# Altium schematic sheet BatteryPack.SchDoc
size A
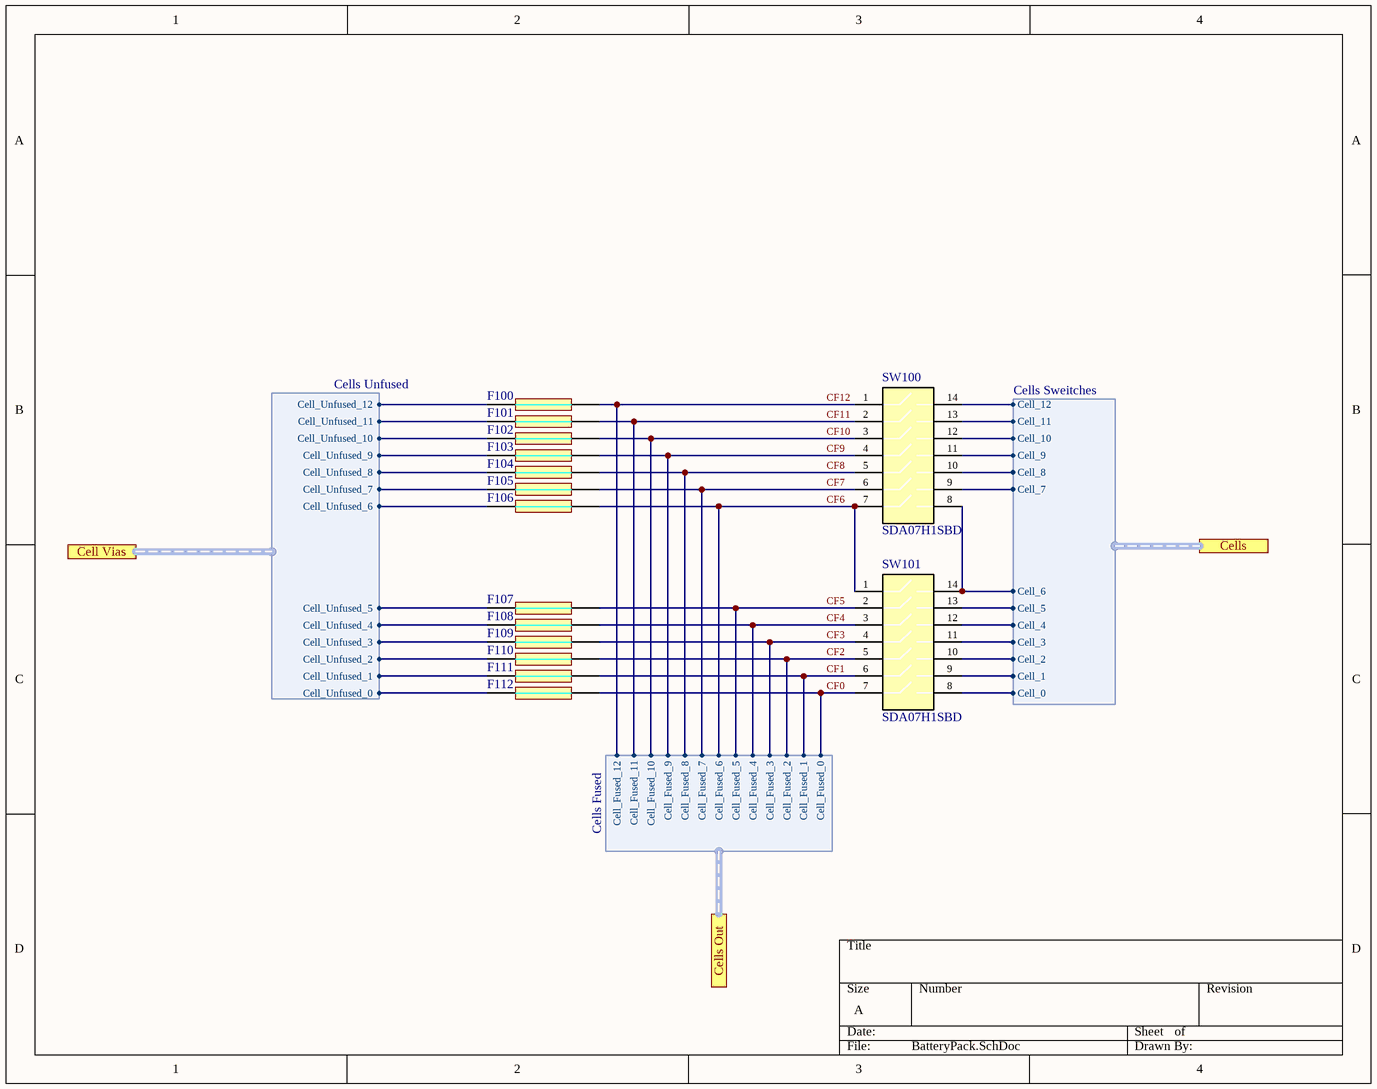
[diagram p0: BatteryPack.SchDoc]

## Parts
F100  SFP200F  [DIOC3216X12N]  (value not drawn)
F101  SFP200F  [DIOC3216X12N]  (value not drawn)
F102  SFP200F  [DIOC3216X12N]  (value not drawn)
F103  SFP200F  [DIOC3216X12N]  (value not drawn)
F104  SFP200F  [DIOC3216X12N]  (value not drawn)
F105  SFP200F  [DIOC3216X12N]  (value not drawn)
F106  SFP200F  [DIOC3216X12N]  (value not drawn)
F107  SFP200F  [DIOC3216X12N]  (value not drawn)
F108  SFP200F  [DIOC3216X12N]  (value not drawn)
F109  SFP200F  [DIOC3216X12N]  (value not drawn)
F110  SFP200F  [DIOC3216X12N]  (value not drawn)
F111  SFP200F  [DIOC3216X12N]  (value not drawn)
F112  SFP200F  [DIOC3216X12N]  (value not drawn)
SW100  SDA07H1SBD  [7 pos Dip-Switch]
SW101  SDA07H1SBD  [7 pos Dip-Switch]

## Ports
Cell Vias (harness Cells Unfused), Cells (harness Cells Sweitches), Cells Out (harness Cells Fused)

## Harnesses
Cells Fused: Cell_Fused_0, Cell_Fused_1, Cell_Fused_2, Cell_Fused_3, Cell_Fused_4, Cell_Fused_5, Cell_Fused_6, Cell_Fused_7, Cell_Fused_8, Cell_Fused_9, Cell_Fused_10, Cell_Fused_11, Cell_Fused_12
Cells Unfused: Cell_Unfused_0, Cell_Unfused_1, Cell_Unfused_2, Cell_Unfused_3, Cell_Unfused_4, Cell_Unfused_5, Cell_Unfused_6, Cell_Unfused_7, Cell_Unfused_8, Cell_Unfused_9, Cell_Unfused_10, Cell_Unfused_11, Cell_Unfused_12
Cells Sweitches: Cell_12, Cell_11, Cell_10, Cell_9, Cell_8, Cell_7, Cell_6, Cell_5, Cell_4, Cell_3, Cell_2, Cell_1, Cell_0

## Nets
CF0: F112.2 SW101.7 ; port Cells Out.Cell_Fused_0
CF1: F111.2 SW101.6 ; port Cells Out.Cell_Fused_1
CF2: F110.2 SW101.5 ; port Cells Out.Cell_Fused_2
CF3: F109.2 SW101.4 ; port Cells Out.Cell_Fused_3
CF4: F108.2 SW101.3 ; port Cells Out.Cell_Fused_4
CF5: F107.2 SW101.2 ; port Cells Out.Cell_Fused_5
CF6: F106.2 SW100.7 SW101.1 ; port Cells Out.Cell_Fused_6
CF7: F105.2 SW100.6 ; port Cells Out.Cell_Fused_7
CF8: F104.2 SW100.5 ; port Cells Out.Cell_Fused_8
CF9: F103.2 SW100.4 ; port Cells Out.Cell_Fused_9
CF10: F102.2 SW100.3 ; port Cells Out.Cell_Fused_10
CF11: F101.2 SW100.2 ; port Cells Out.Cell_Fused_11
CF12: F100.2 SW100.1 ; port Cells Out.Cell_Fused_12
NetF100_1: F100.1 ; port Cell Vias.Cell_Unfused_12
NetF101_1: F101.1 ; port Cell Vias.Cell_Unfused_11
NetF102_1: F102.1 ; port Cell Vias.Cell_Unfused_10
NetF103_1: F103.1 ; port Cell Vias.Cell_Unfused_9
NetF104_1: F104.1 ; port Cell Vias.Cell_Unfused_8
NetF105_1: F105.1 ; port Cell Vias.Cell_Unfused_7
NetF106_1: F106.1 ; port Cell Vias.Cell_Unfused_6
NetF107_1: F107.1 ; port Cell Vias.Cell_Unfused_5
NetF108_1: F108.1 ; port Cell Vias.Cell_Unfused_4
NetF109_1: F109.1 ; port Cell Vias.Cell_Unfused_3
NetF110_1: F110.1 ; port Cell Vias.Cell_Unfused_2
NetF111_1: F111.1 ; port Cell Vias.Cell_Unfused_1
NetF112_1: F112.1 ; port Cell Vias.Cell_Unfused_0
NetSW100_8: SW100.8 SW101.14 ; port Cells.Cell_6
NetSW100_9: SW100.9 ; port Cells.Cell_7
NetSW100_10: SW100.10 ; port Cells.Cell_8
NetSW100_11: SW100.11 ; port Cells.Cell_9
NetSW100_12: SW100.12 ; port Cells.Cell_10
NetSW100_13: SW100.13 ; port Cells.Cell_11
NetSW100_14: SW100.14 ; port Cells.Cell_12
NetSW101_8: SW101.8 ; port Cells.Cell_0
NetSW101_9: SW101.9 ; port Cells.Cell_1
NetSW101_10: SW101.10 ; port Cells.Cell_2
NetSW101_11: SW101.11 ; port Cells.Cell_3
NetSW101_12: SW101.12 ; port Cells.Cell_4
NetSW101_13: SW101.13 ; port Cells.Cell_5

## Library data of the parts
F100-F112 = SFP200F: Surface Mount Fuses VERY FAST GLASS CER 63V 2A SZ 1206
SW100 SW101 = Dip Switches: Dip Switch SPST 7 Position Surface Mount Slide (Standard) Actuator 25mA 24VDC